# EAGLE design MP3 Breakout (EAGLE 9.0.1)
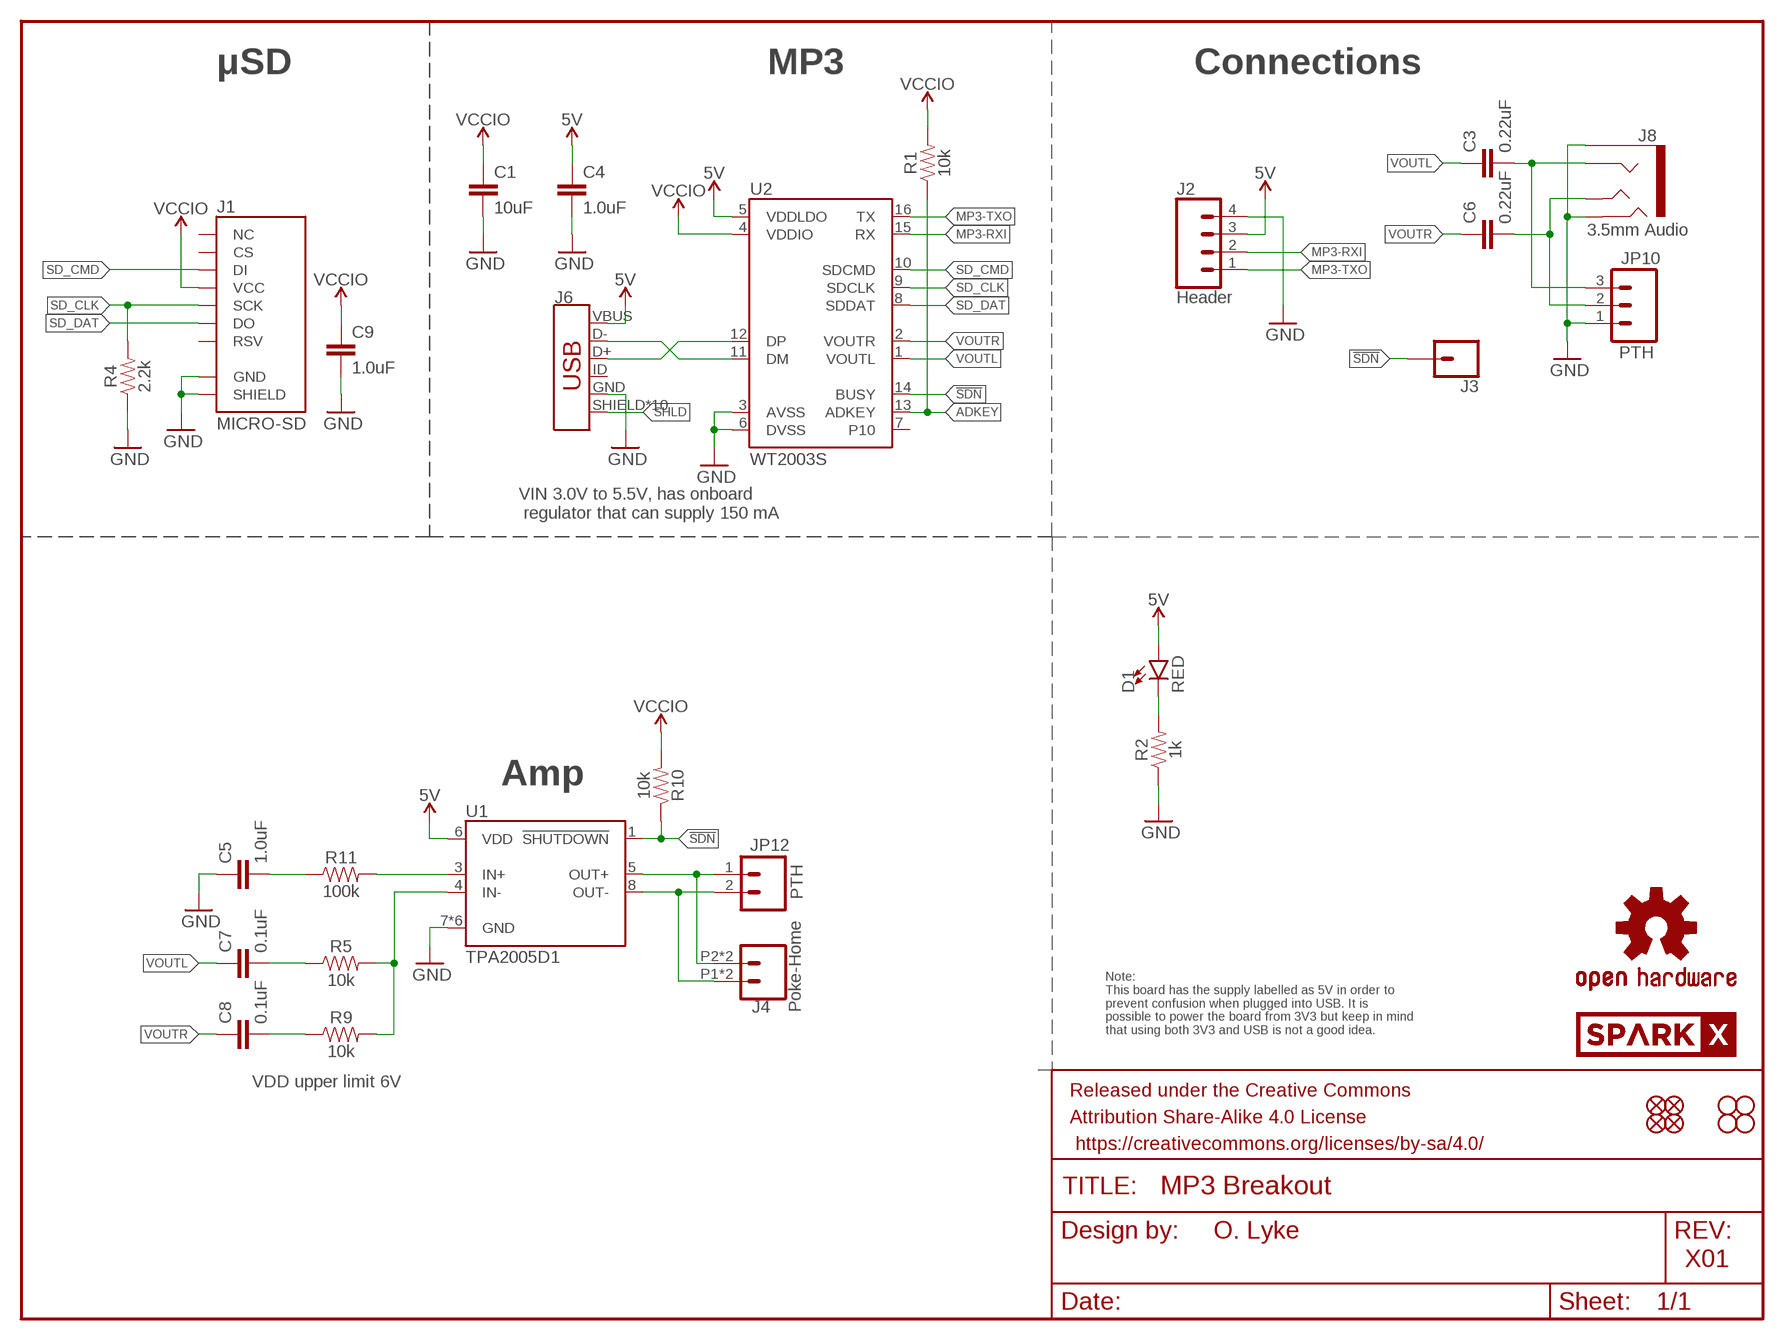
[diagram p0: schematic, sheet 1]

## Parts
C1  10uF  10UF-0603-6.3V-20%  [0603]
C3  0.22uF  0.22UF-0603-25V-10%  [0603]
C4  1.0uF  1.0UF-0603-16V-10%  [0603]
C5  1.0uF  1.0UF-0603-16V-10%  [0603]
C6  0.22uF  0.22UF-0603-25V-10%  [0603]
C7  0.1uF  0.1UF-0603-25V-(+80/-20%)  [0603]
C8  0.1uF  0.1UF-0603-25V-(+80/-20%)  [0603]
C9  1.0uF  1.0UF-0603-16V-10%  [0603]
D1  RED  LED-RED0603  [LED-0603]
FRAME1  FRAME-LETTER  [CREATIVE_COMMONS]
J1  MICRO-SD  MICRO-SD_CARD_SOCKETPUSH-PUSH  [MICRO-SD-SOCKET]
J2  Header  CONN_041X04_NO_SILK  [1X04_NO_SILK]
J3  CONN_01PTH_NO_SILK_YES_STOP  [1X01_NO_SILK]
J4  Poke-Home  CONN_02SMALL_POKEHOME  [1X02_POKEHOME]
J6  USB_MICRO-B_HALF_PTH_MILL  [USB-MICROB-PTH-MILL]
J8  3.5mm Audio  AUDIO_JACK_TRRSSMD_RA  [AUDIO_JACK_3.5MM_TRRS_SMD_RA]
JP1  FIDUCIALUFIDUCIAL  [MICRO-FIDUCIAL]
JP2  FIDUCIALUFIDUCIAL  [MICRO-FIDUCIAL]
JP3  STAND-OFF  [STAND-OFF]
JP4  STAND-OFF  [STAND-OFF]
JP5  FIDUCIALUFIDUCIAL  [MICRO-FIDUCIAL]
JP6  FIDUCIALUFIDUCIAL  [MICRO-FIDUCIAL]
JP10  PTH  CONN_031X03_NO_SILK  [1X03_NO_SILK]
JP11  STAND-OFF  [STAND-OFF]
JP12  PTH  CONN_021X02_NO_SILK  [1X02_NO_SILK]
JP13  STAND-OFF  [STAND-OFF]
LOGO1  OSHW-LOGOMINI  [OSHW-LOGO-MINI]
R1  10k  10KOHM-0603-1/10W-1%  [0603]
R2  1k  1KOHM-0603-1/10W-1%  [0603]
R4  2.2k  2.2KOHM-0603-1/10W-1%  [0603]
R5  10k  10KOHM-0603-1/10W-1%  [0603]
R9  10k  10KOHM-0603-1/10W-1%  [0603]
R10  10k  10KOHM-0603-1/10W-1%  [0603]
R11  100k  100KOHM-0603-1/10W-1%  [0603]
U1  TPA2005D1  TPA2005D1DRB  [QFN-8_PAD]
U2  WT2003S  [SO16]
U$2  SPARKX-LOGO4  [SPARKX-MEDIUM]

## Nets
5V: C4.1 D1.A J2.3 J6.VBUS U1.6(VDD) U2.5(VDDLDO)
!SDN: J3.1 R10.1 U1.1(!SHUTDOWN) U2.14(BUSY)
AC-L: C3.2 J8.RING1 JP10.3
AC-R: C6.2 J8.TIP JP10.2
ADKEY: R1.1 U2.13(ADKEY)
D+: J6.D+ U2.12(DP)
D-: J6.D- U2.11(DM)
GND: C1.2 C4.2 C5.1 C9.2 J1.CD1(SHIELD) J1.GND J2.4 J6.GND J8.EARTH J8.RING2 JP10.1 R2.1 R4.1 U1.7(GND) U1.9(GND) U1.10(GND) U1.11(GND) U1.12(GND) U1.13(GND) U2.3(AVSS) U2.6(DVSS)
IN+AMP: R11.2 U1.3(IN+)
IN-AMP: R5.2 R9.2 U1.4(IN-)
MP3-RXI: J2.2 U2.15(RX)
MP3-TXO: J2.1 U2.16(TX)
N$1: D1.C R2.2
N$5: C8.2 R9.1
N$8: C5.2 R11.1
N$9: C7.2 R5.1
OUT+: J4.P2 J4.P4 JP12.1 U1.5(OUT+)
OUT-: J4.P1 J4.P3 JP12.2 U1.8(OUT-)
SD_CLK: J1.SCLK(SCK) R4.2 U2.9(SDCLK)
SD_CMD: J1.DI U2.10(SDCMD)
SD_DAT: J1.DO U2.8(SDDAT)
SHLD: J6.SHIELD J6.SHIELD2(SHIELD) J6.SHIELD3(SHIELD) J6.SHIELD4(SHIELD) J6.SHIELD5(SHIELD) J6.SHIELD6(SHIELD) J6.SHIELD7(SHIELD) J6.SHIELD8(SHIELD) J6.SHIELD9(SHIELD) J6.SHIELD10(SHIELD)
VCCIO: C1.1 C9.1 J1.VCC R1.2 R10.2 U2.4(VDDIO)
VOUTL: C3.1 C7.1 U2.1(VOUTL)
VOUTR: C6.1 C8.1 U2.2(VOUTR)
Unconnected: J1.CS J1.RSV1(RSV) J1.RSV2(NC) J6.ID U2.7(P10)

## Notes on the sheet
- μSD | MP3 | Connections
- VIN 3.0V to 5.5V, has onboard
   regulator that can supply 150 mA
- Amp
- Note:
  This board has the supply labelled as 5V in order to 
  prevent confusion when plugged into USB. It is 
  possible to power the board from 3V3 but keep in mind 
  that using both 3V3 and USB is not a good idea.
- VDD upper limit 6V
- O. Lyke
- X01

## Library data of the parts
C1 = SparkFun-Capacitors:10UF: 10.0µF ceramic capacitors A capacitor is a passive two-terminal electrical component used to store electrical energy temporarily in an electric field.; PROD_ID: CAP-11015
C3 C6 = SparkFun-Capacitors:0.22UF: 0.22µF ceramic capacitors A capacitor is a passive two-terminal electrical component used to store electrical energy temporarily in an electric field.; PROD_ID: CAP-07822
C4 C5 C9 = SparkFun-Capacitors:1.0UF: 1µF ceramic capacitors A capacitor is a passive two-terminal electrical component used to store electrical energy temporarily in an electric field.; PROD_ID: CAP-00868
C7 C8 = SparkFun-Capacitors:0.1UF: 0.1µF ceramic capacitors A capacitor is a passive two-terminal electrical component used to store electrical energy temporarily in an electric field.; PROD_ID: CAP-00810
D1 = SparkFun-LED:LED-RED: Red SMD LED Used in manufacturing of most products at SparkFun Packages: 0603 - SMD 0603 package [Product Link] <http://docs.avagotech.com/docs/AV02-0551EN> 0603 SMART - SMD 0603 SMART package ( more efficient and expensive)[Product Link] <http://www.osram-os.com/Graphics/XPic2/00077099_0.pdf> 1206 - SMD1206 package [Product Link] <https://www.sparkfun.com/datasheets/DevTools/LilyPad/Q150OVS4.pdff> SparkFun Products: Pro Mini 328 -5V <https://www.sparkfun.com/products/821> RedBoard <https://www.sparkfun.com/products/12757> IOIO-OTG <https://www.sparkfun.com/products/13613>; PROD_ID: DIO-00819
FRAME1 = SparkFun-Aesthetics:FRAME-LETTER: Schematic Frame - Letter Standard 8.5x11 US Letter frame
J1 = SparkFun-Connectors:MICRO-SD_CARD_SOCKET: microSD Socket for Transflash Push-push type µSD socket. tDoc lines correctly indicate media card edge positions when inserting (unlocked, locked, depressed). NOTE: CD1 and CD2 are connected internally, and the default detect state of the socket is detect pin to ground. SparkFun Products: WAV Trigger <https://www.sparkfun.com/products/13660> CAN-Bus Shield <https://www.sparkfun.com/products/13262> SparkFun Level Shifing microSD Breakout <https://www.sparkfun.com/products/13743>; PROD_ID: CONN-07820
J2 = SparkFun-Connectors:CONN_04: Multi connection point. Often used as Generic Header-pin footprint for 0.1 inch spaced/style header connections On any of the 0.1 inch spaced packages, you can populate with these: Break Away Headers - Straight <https://www.sparkfun.com/products/116> (PRT-00116) Break Away Male Headers - Right Angle <https://www.sparkfun.com/products/553> (PRT-00553) Female Headers <https://www.sparkfun.com/products/115> (PRT-00115) Break Away Headers - Machine Pin <https://www.sparkfun.com/products/117> (PRT-00117) Break Away Female Headers - Swiss Machine Pin <https://www.sparkfun.com/products/743> (PRT-00743) For SCREWTERMINALS and SPRING TERMINALS visit here: Screw Terimnals on SparkFun.com <https://www.sparkfun.com/search/results?term=Screw+Terminals> (5mm/3.5mm/2.54mm spacing) This device is also useful as a general connection point to wire up your design to another part of your project. Our various solder wires solder well into these plated through hole pads. Hook-Up Wire - Assortment (Stranded, 22 AWG) <https://www.sparkfun.com/products/11375> (PRT-11375) Hook-Up Wire - Assortment (Solid Core, 22 AWG) <https://www.sparkfun.com/products/11367> (PRT-11367) View the entire wire category on our website here <https://www.sparkfun.com/categories/141> Special notes: Molex polarized connector foot print use with SKU : PRT-08231 with associated crimp pins and housings. 1MM SMD Version SKU: PRT-10208; PROD_ID: CONN-09696
J3 = SparkFun-Connectors:CONN_01: Single connection point. Often used as Generic Header-pin footprint for 0.1 inch spaced/style header connections On any of the 0.1 inch spaced packages, you can populate with these: Break Away Headers - Straight <https://www.sparkfun.com/products/116> (PRT-00116) Break Away Male Headers - Right Angle <https://www.sparkfun.com/products/553> (PRT-00553) Female Headers <https://www.sparkfun.com/products/115> (PRT-00115) Break Away Headers - Machine Pin <https://www.sparkfun.com/products/117> (PRT-00117) Break Away Female Headers - Swiss Machine Pin <https://www.sparkfun.com/products/743> (PRT-00743) This device is also useful as a general connection point to wire up your design to another part of your project. Our various solder wires solder well into these plated through hole pads. Hook-Up Wire - Assortment (Stranded, 22 AWG) <https://www.sparkfun.com/products/11375> (PRT-11375) Hook-Up Wire - Assortment (Solid Core, 22 AWG) <https://www.sparkfun.com/products/11367> (PRT-11367) View the entire wire category on our website here <https://www.sparkfun.com/categories/141> Special notes: SMTSO-256-ET is a "flush mount" nut for a 4-40 screw. We mostly use this on specialty testbeds; it is a nice way to connect hardware to your PCB at an adjustable hieght. Also note, the SNAP packages are for using a snappable style connector. We sell a baggie of snaps and they are also used on two LilyPad designs: Snap Assortment - 30 pack (male and female) <https://www.sparkfun.com/products/11347> (DEV-11347) LilyPad Arduino SimpleSnap <https://www.sparkfun.com/products/10941> (DEV-10941) LilyPad SimpleSnap Protoboard <https://www.sparkfun.com/products/10940> (DEV-10940)
J4 = SparkFun-Connectors:CONN_02: Multi connection point. Often used as Generic Header-pin footprint for 0.1 inch spaced/style header connections On any of the 0.1 inch spaced packages, you can populate with these: Break Away Headers - Straight <https://www.sparkfun.com/products/116> (PRT-00116) Break Away Male Headers - Right Angle <https://www.sparkfun.com/products/553> (PRT-00553) Female Headers <https://www.sparkfun.com/products/115> (PRT-00115) Break Away Headers - Machine Pin <https://www.sparkfun.com/products/117> (PRT-00117) Break Away Female Headers - Swiss Machine Pin <https://www.sparkfun.com/products/743> (PRT-00743) For SCREWTERMINALS and SPRING TERMINALS visit here: Screw Terimnals on SparkFun.com <https://www.sparkfun.com/search/results?term=Screw+Terminals> (5mm/3.5mm/2.54mm spacing) This device is also useful as a general connection point to wire up your design to another part of your project. Our various solder wires solder well into these plated through hole pads. Hook-Up Wire - Assortment (Stranded, 22 AWG) <https://www.sparkfun.com/products/11375> (PRT-11375) Hook-Up Wire - Assortment (Solid Core, 22 AWG) <https://www.sparkfun.com/products/11367> (PRT-11367) View the entire wire category on our website here <https://www.sparkfun.com/categories/141> Special notes: Molex polarized connector foot print use with: PRT-08233 with associated crimp pins and housings. 2.54_SCREWTERM for use with PRT-10571. 3.5mm Screw Terminal footprints for PRT-08084 5mm Screw Terminal footprints for use with PRT-08432; PROD_ID: CONN-13512
J6 = SparkFun-Connectors:USB_MICRO-B: USB Type Micro-B Connector Male/female and PTH/SMT variants SparkFun Products: SparkFun microB USB Breakout <https://www.sparkfun.com/products/12035> SparkFun USB microB Plug Breakout <https://www.sparkfun.com/products/10031> SparkFun ESP8266 Thing <https://www.sparkfun.com/products/13231>; PROD_ID: CONN-13711
J8 = SparkFun-Connectors:AUDIO_JACK_TRRS: Audio Jack - 3.5mm TRRS (SMD) This is a 3.5mm TRRS SMD audio jack. TRRS connectors are the audio-style connectors that you see on some phones, MP3 players and development boards. TRRS stands for “tip, ring, ring, sleeve,” which reflects that this has three conductors and a ground. SparkFun Products: Audio Jack <https://www.sparkfun.com/products/12639> mbed Starter Kit <https://www.sparkfun.com/products/12968> SparkFun TRRS 3.5mm Jack Breakout <https://www.sparkfun.com/products/11570>; PROD_ID: CONN-10676; SF_ID: PRT-12639
JP1 JP2 JP5 JP6 = SparkFun:FIDUCIAL: Fiducial Alignment Points Various fiducial points for machine vision alignment.
JP3 JP4 JP11 JP13 = SparkFun:STAND-OFF: Stand Off This is the mechanical footprint for a #4 phillips button head screw. Use the keepout ring to avoid running the screw head into surrounding components. SKU : PRT-00447
JP10 = SparkFun-Connectors:CONN_03: Multi connection point. Often used as Generic Header-pin footprint for 0.1 inch spaced/style header connections On any of the 0.1 inch spaced packages, you can populate with these: Break Away Headers - Straight <https://www.sparkfun.com/products/116> (PRT-00116) Break Away Male Headers - Right Angle <https://www.sparkfun.com/products/553> (PRT-00553) Female Headers <https://www.sparkfun.com/products/115> (PRT-00115) Break Away Headers - Machine Pin <https://www.sparkfun.com/products/117> (PRT-00117) Break Away Female Headers - Swiss Machine Pin <https://www.sparkfun.com/products/743> (PRT-00743) Stackable Header - 3 Pin (Female, 0.1") <https://www.sparkfun.com/products/13875> (PRT-13875) For SCREWTERMINALS and SPRING TERMINALS visit here: Screw Terimnals on SparkFun.com <https://www.sparkfun.com/search/results?term=Screw+Terminals> (5mm/3.5mm/2.54mm spacing) This device is also useful as a general connection point to wire up your design to another part of your project. Our various solder wires solder well into these plated through hole pads. Hook-Up Wire - Assortment (Stranded, 22 AWG) <https://www.sparkfun.com/products/11375> (PRT-11375) Hook-Up Wire - Assortment (Solid Core, 22 AWG) <https://www.sparkfun.com/products/11367> (PRT-11367) View the entire wire category on our website here <https://www.sparkfun.com/categories/141> Special notes: Molex polarized connector foot print use with SKU : PRT-08232 with associated crimp pins and housings.
JP12 = SparkFun-Connectors:CONN_02: Multi connection point. Often used as Generic Header-pin footprint for 0.1 inch spaced/style header connections On any of the 0.1 inch spaced packages, you can populate with these: Break Away Headers - Straight <https://www.sparkfun.com/products/116> (PRT-00116) Break Away Male Headers - Right Angle <https://www.sparkfun.com/products/553> (PRT-00553) Female Headers <https://www.sparkfun.com/products/115> (PRT-00115) Break Away Headers - Machine Pin <https://www.sparkfun.com/products/117> (PRT-00117) Break Away Female Headers - Swiss Machine Pin <https://www.sparkfun.com/products/743> (PRT-00743) For SCREWTERMINALS and SPRING TERMINALS visit here: Screw Terimnals on SparkFun.com <https://www.sparkfun.com/search/results?term=Screw+Terminals> (5mm/3.5mm/2.54mm spacing) This device is also useful as a general connection point to wire up your design to another part of your project. Our various solder wires solder well into these plated through hole pads. Hook-Up Wire - Assortment (Stranded, 22 AWG) <https://www.sparkfun.com/products/11375> (PRT-11375) Hook-Up Wire - Assortment (Solid Core, 22 AWG) <https://www.sparkfun.com/products/11367> (PRT-11367) View the entire wire category on our website here <https://www.sparkfun.com/categories/141> Special notes: Molex polarized connector foot print use with: PRT-08233 with associated crimp pins and housings. 2.54_SCREWTERM for use with PRT-10571. 3.5mm Screw Terminal footprints for PRT-08084 5mm Screw Terminal footprints for use with PRT-08432
LOGO1 = SparkFun-Aesthetics:OSHW-LOGO: Open-Source Hardware (OSHW) Logo This logo indicates the piece of hardware it is found on incorporates a OSHW license and/or adheres to the definition of open source hardware found here: http://freedomdefined.org/OSHW
R1 R5 R9 R10 = SparkFun-Resistors:10KOHM: 10kΩ resistor A resistor is a passive two-terminal electrical component that implements electrical resistance as a circuit element. Resistors act to reduce current flow, and, at the same time, act to lower voltage levels within circuits. - Wikipedia; PROD_ID: RES-00824
R2 = SparkFun-Resistors:1KOHM: 1kΩ resistor A resistor is a passive two-terminal electrical component that implements electrical resistance as a circuit element. Resistors act to reduce current flow, and, at the same time, act to lower voltage levels within circuits. - Wikipedia; PROD_ID: RES-07856
R4 = SparkFun-Resistors:2.2KOHM: 2.2kΩ resistor A resistor is a passive two-terminal electrical component that implements electrical resistance as a circuit element. Resistors act to reduce current flow, and, at the same time, act to lower voltage levels within circuits. - Wikipedia; PROD_ID: RES-08272
R11 = SparkFun-Resistors:100KOHM: 100kΩ resistor A resistor is a passive two-terminal electrical component that implements electrical resistance as a circuit element. Resistors act to reduce current flow, and, at the same time, act to lower voltage levels within circuits. - Wikipedia; PROD_ID: RES-07828
U1 = SparkFun-IC-Amplifiers:TPA2005D1: 1.4W MONO CLASS-D AUDIO POWER AMPLIFIER The TPA2005D1 is a 1.4-W high efficiency filter-free class-D audio power amplifier in a BGA, QFN, or MSOP package that requires only three external components. Datasheet: http://focus.ti.com/lit/ds/symlink/tpa2005d1.pdf 1.4 W Into 8 ? From a 5V Supply at THD = 10% (Typ) Maximum Battery Life and Minimum Heat Efficiency With an 8-? Speaker: 84% at 400 mW, 79% at 100 mW 2.8-mA Quiescent Current 0.5-mA Shutdown Current Ideal for Wireless or Cellular Handsets and PDAs Capable of Driving an 8-? Speaker (2.5 V ? VDD ? 5.5 V) and a 4-? Speaker (2.5 V ? VDD ? 4.2 V) Only Three External Components Optimized PWM Output Stage Eliminates LC Output Filter Internally Generated 250-kHz Switching Frequency Eliminates Capacitor and Resistor Improved PSRR (-71 dB at 217 Hz) and Wide Supply Voltage (2.5 V to 5.5 V) Eliminates Need for a Voltage Regulator Fully Differential Design Reduces RF Rectification and Eliminates Bypass Capacitor Improved CMRR Eliminates Two Input Coupling Capacitors SparkFun Products SparkFun Mono Audio Amp Breakout - TPA2005D1 <https://www.sparkfun.com/products/11044> (BOB-11044) Note: SparkFun currenly only uses the QFN style part; PROD_ID: IC-10975
U2 = WT2003S:WT2003S
U$2 = SparkX:SPARKX-LOGO

## Net classes
1 3.3V: width 0.152 mm

## Board
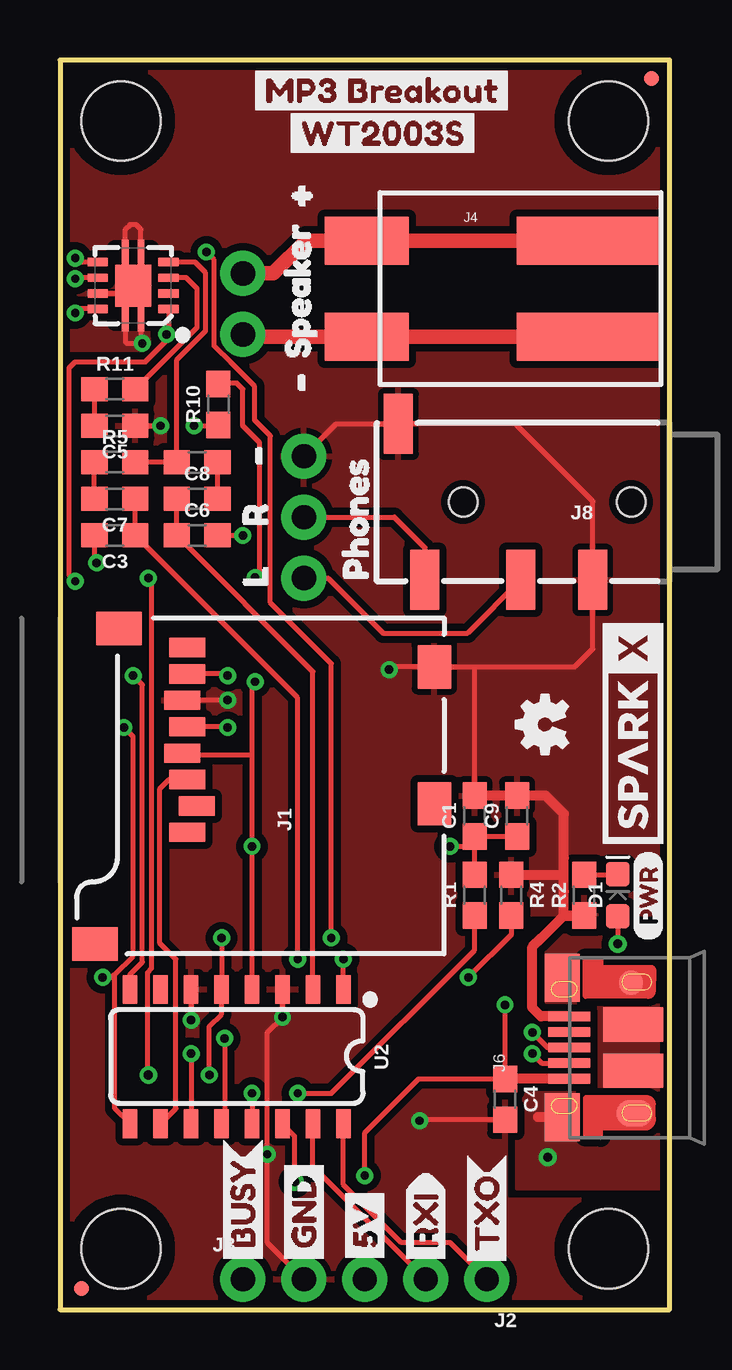
[diagram p1: board, top side]
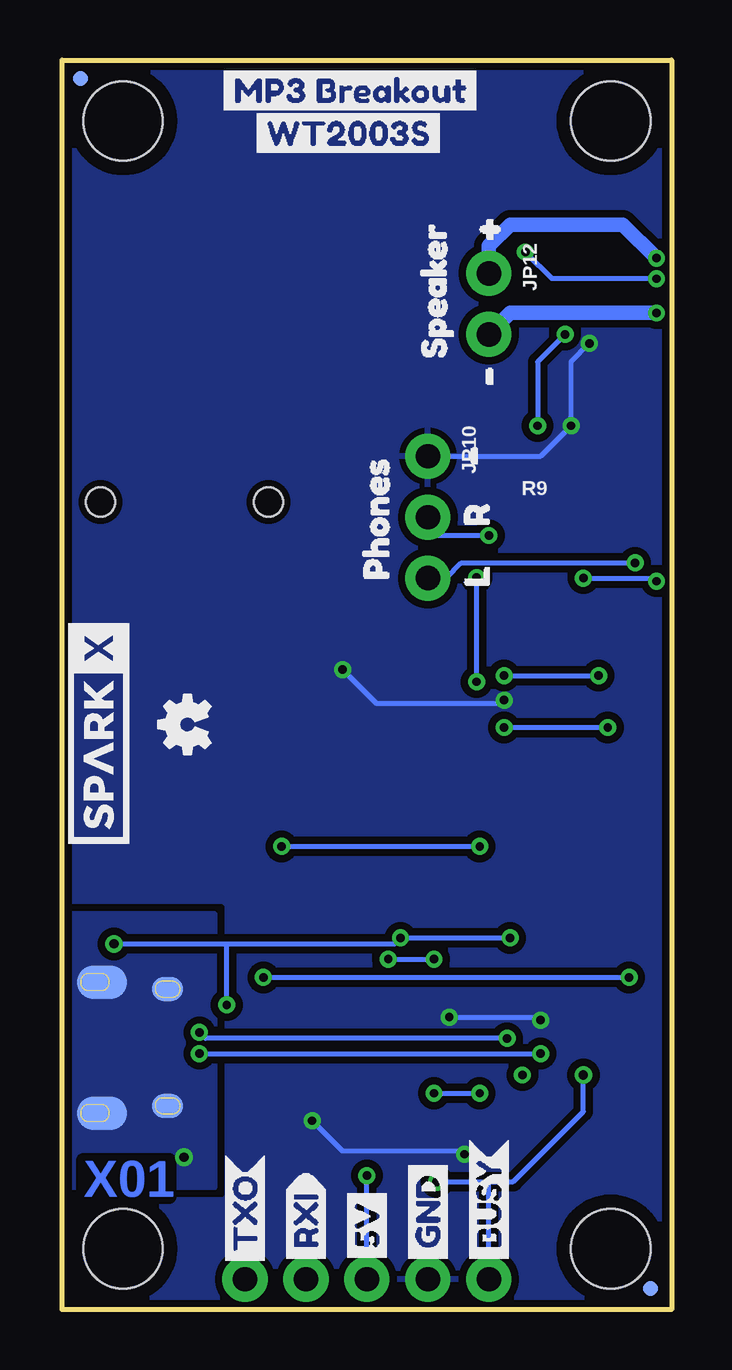
[diagram p2: board, bottom side, seen from below]

Size 25.4 x 52.07 mm. Coordinates in mm from the lower left corner, seen from the top.
Outline: 25.4,0 25.4,52.07 0,52.07 0,0 25.4,0
Copper layers (1*16): Top 0.035mm / dielectric 1.5mm / Bottom 0.035mm
Design rules "SparkFun-2-layer-PCBWay-LIMIT *": minimum track width 6mil, minimum drill 0.3mm, track to track 6mil, track to pad 6mil, pad to pad 6mil, via to via 6mil, smd to smd 6mil, copper to edge 6mil, drill to drill 6mil, minimum pad ring 7mil, minimum via ring 7mil, stop-mask expansion 4mil, vias tented up to drill 25mil, thermal gap 10mil

### Footprints (pad centres in the part's own frame; a part is rotated, then mirrored left to right if it is on the bottom)
0603 = smd 1.1 x 1: 1 -0.85,0; 2 0.85,0
LED-0603 = smd 1 x 1: A -0.877,0; C 0.877,0
MICRO-SD-SOCKET = smd 1.8 x 1.4: CD1 -2.05,0.4; CD2 -7.75,0.4 | smd 0.8 x 1.5: CS -7.84,10.3; DI -6.74,10.7; DO -2.34,10.7; GND -3.44,10.9; RSV1 -8.94,10.7; RSV2 -1.24,10.7; SCLK -4.54,10.7; VCC -5.64,10.9 | smd 1.4 x 1.9: GND1 -13.6,14.55; GND3 -0.45,13.55
1X04_NO_SILK = drill 1.016 pad 1.88: 1 0,0; 2 2.54,0; 3 5.08,0; 4 7.62,0
1X01_NO_SILK = drill 1.016 pad 1.88: 1 0,0
1X02_POKEHOME = smd 3.5 x 2: P1 5.25,2; P2 5.25,-2 | smd 6 x 2: P3 -4,2; P4 -4,-2
USB-MICROB-PTH-MILL = smd 0.4 x 1.75: D+ 0,0; D- -0.65,0; GND 1.3,0; ID 0.65,0; VBUS -1.3,0 | smd 2 x 1.46: SHIELD -2.9,0.275; SHIELD2 2.9,0.275 | smd 1.425 x 2.5: SHIELD3 -0.963,-2.675; SHIELD4 0.963,-2.675 | smd 1.4 x 2.1 bottom: SHIELD5 -2.731,-2.531; SHIELD7 2.729,-2.531 | smd 1 x 1: SHIELD6 2.7,-2.575 | smd 1.1 x 1.5: SHIELD8 -2.731,-2.731 | smd 1 x 1.3 bottom: SHIELD9 -2.43,0.195; SHIELD10 2.43,0.195
AUDIO_JACK_3.5MM_TRRS_SMD_RA = smd 1.2 x 2.5: EARTH 11.3,-3.25; RING1 6.2,3.25; RING2 3.2,3.25; TIP 10.2,3.25 | hole 1.2: 1.6,0; 8.6,0
MICRO-FIDUCIAL = smd 0.635 x 0.635: 1 0,0
STAND-OFF = hole 3.302: 0,0
1X03_NO_SILK = drill 1.016 pad 1.88: 1 0,0; 2 2.54,0; 3 5.08,0
1X02_NO_SILK = drill 1.016 pad 1.88: 1 0,0; 2 2.54,0
QFN-8_PAD = smd 0.35 x 0.85: 1 -0.975,-1.475; 2 -0.325,-1.475; 3 0.325,-1.475; 4 0.975,-1.475; 5 0.975,1.475; 6 0.325,1.475; 7 -0.325,1.475; 8 -0.975,1.475 | smd 1.75 x 1.5: 9 0,0 | smd 1.025 x 0.28: 10 -1.387,-0.325; 11 1.387,-0.325; 12 1.387,0.325; 13 -1.387,0.325
SO16 = smd 0.6 x 1.2: 1 -4.445,-2.8; 2 -3.175,-2.8; 3 -1.905,-2.8; 4 -0.635,-2.8; 5 0.635,-2.8; 6 1.905,-2.8; 7 3.175,-2.8; 8 4.445,-2.8; 9 4.445,2.8; 10 3.175,2.8; 11 1.905,2.8; 12 0.635,2.8; 13 -0.635,2.8; 14 -1.905,2.8; 15 -3.175,2.8; 16 -4.445,2.8

### Placement (x,y rotation side)
C1  17.27,20.57 90 top
C3  2.29,32.26 180 top
C4  18.54,8.76 270 top
C5  2.29,36.83 180 top
C6  5.71,32.26 0 top
C7  2.29,33.78 180 top
C8  5.71,33.78 0 top
C9  19.05,20.57 90 top
D1  23.24,17.27 90 top
FRAME1  -16.64,-15.88 0 top  (outside the outline)
J1  16,28.83 90 top
J2  17.78,1.27 180 top
J3  7.62,1.27 0 top
J4  18.03,42.55 180 top
J6  21.21,10.92 90 top
J8  25.4,33.66 180 top
JP1  24.64,51.31 0 top
JP2  0.89,0.89 0 bottom
JP3  22.86,49.53 0 top
JP4  2.54,49.53 0 top
JP5  0.89,0.89 0 top
JP6  24.64,51.31 0 bottom
JP10  10.16,35.56 270 bottom
JP11  22.86,2.54 0 top
JP12  7.62,43.18 270 bottom
JP13  2.54,2.54 0 top
LOGO1  20.19,24.38 90 top
LOGO2  OSHW-LOGOMINI  [OSHW-LOGO-MINI@1]  20.19,24.38 90 bottom
R1  17.27,17.27 90 top
R2  21.84,17.27 90 top
R4  18.8,17.27 270 top
R5  2.29,35.31 0 top
R9  5.71,35.31 180 top
R10  6.6,37.72 90 top
R11  2.29,38.35 0 top
U1  3.05,42.67 90 top
U2  7.37,10.54 180 top
U$1  [GND1]  10.16,1.65 90 bottom
U$2  23.88,24 90 top
U$3  [L12]  8.13,29.21 90 bottom
U$4  [R11]  8.13,31.75 90 bottom
U$6  [TXO0]  17.78,1.52 90 top
U$7  [RXI0]  15.24,1.65 90 top
U$8  [RXI0]  15.24,1.65 90 bottom
U$9  [TXO0]  17.78,1.52 90 bottom
U$10  [#6]  8,34.04 90 top
U$11  SPARKX-LOGO4  [SPARKX-MEDIUM]  23.88,24 90 bottom
U$12  [MP3_BREAKOUT0]  7.62,50.8 0 top
U$13  [BUSY0]  7.62,1.65 90 top
U$14  [BUSY0]  7.62,1.65 90 bottom
U$15  [#6]  8.51,34.04 90 bottom
U$16  [PHONES0]  12.32,29.34 90 bottom
U$17  [PWR-()-03]  24.51,15.37 90 top
U$18  [SPEAKER1]  9.91,38.73 90 bottom
U$19  [#5]  7.75,43.43 90 bottom
U$20  [SPEAKER1]  9.91,38.73 90 top
U$21  [#6]  7.87,37.34 90 bottom
U$22  [GND1]  10.16,1.65 90 top
U$23  [RXI0]  15.24,1.65 90 top
U$24  [MP3_BREAKOUT0]  19.18,50.8 0 bottom
U$25  [#6]  9.78,37.08 90 top
U$26  [WT2003S0]  9.14,49.02 0 top
U$27  [WT2003S0]  17.78,49.02 0 bottom
U$28  [#5]  9.91,44.83 90 top
U$29  [5V0]  12.7,1.65 90 top
U$30  [5V0]  12.7,1.65 90 bottom
U$39  [R11]  8.13,31.75 90 top
U$40  [PHONES0]  12.32,29.34 90 top
U$41  [L12]  8.13,29.21 90 top

### Tracks (layer width: path | path; a pad name or v marks a point on that pad's centre or on a via)
5V  (via drill 0.35, 0.38)
  Top 0.203: v6.22,9.78 6.22,11.81 6.73,12.32 U2.5 v6.73,15.49 | v0.64,42.96 0.68,43 U1.6 | 18.58,9.65 C4.1 | v12.7,5.59 12.7,7.37 14.95,9.61 C4.1 | C4.1 v18.54,12.7 | v11.3,15.49 11.3,26.92 8.76,29.46 8.76,36.41 8.11,37.06 8.11,38.47 7.14,39.45 7.13,39.45 6.43,40.15 6.43,43.74 v6.1,44.07 | D1.A v23.24,15.24
  Top 0.406: J6.VBUS 18.55,9.62 C4.1
  Bottom 0.203: v6.73,15.49 v11.3,15.49 11.56,15.24 18.54,15.24 | v0.64,42.96 4.98,42.96 v6.1,44.07 | J2.3 v12.7,5.59 | v23.24,15.24 18.54,15.24 | v18.54,12.7 18.54,15.24
!SDN  (via drill 0.35, 0.38)
  Top 0.203: U1.1 4.52,40.72 v4.45,40.64 4.45,40.39 3.56,39.5 0.64,39.5 0.38,39.24 0.38,30.61 v0.64,30.35 | v5.59,36.83 6.57,36.83 R10.1 | v3.68,30.48 3.81,30.35 3.81,14.22 3.64,14.05 3.64,9.82 v3.68,9.78 | v9.78,5.33 9.78,7.23 U2.14
  Bottom 0.203: v4.45,40.64 5.59,39.5 v5.59,36.83 | v3.68,30.48 0.76,30.48 v0.64,30.35 | v3.68,9.78 3.68,8.26 6.6,5.33 7.62,5.33 | v9.78,5.33 7.62,5.33 | J3.1 7.62,5.33
AC-L  (via drill 0.35)
  Top 0.203: C3.2 1.44,31.2 v1.52,31.11 | 19.2,29.95 J8.RING1 16.99,28.19 13.46,28.19 11.18,30.48 JP10.3
  Bottom 0.203: v1.52,31.11 8.76,31.11 9.4,30.48 JP10.3
AC-R  (via drill 0.35)
  Top 0.203: J8.TIP 15.2,31.75 13.93,33.02 JP10.2 | C6.2 v7.62,32.26
  Bottom 0.203: v7.62,32.26 9.78,32.26 9.78,32.64 JP10.2
ADKEY  (via drill 0.35)
  Top 0.203: v9.91,9.02 11.3,9.02 17.27,14.99 R1.1 | v8,9.02 U2.13
  Bottom 0.203: v9.91,9.02 v8,9.02
D+  (via drill 0.35)
  Top 0.203: v6.86,11.3 6.86,7.87 U2.12 | v19.68,11.56 20.32,10.92 J6.D+
  Bottom 0.203: v6.86,11.3 19.43,11.3 v19.68,11.56
D-  (via drill 0.35)
  Top 0.203: v5.46,10.67 U2.11 | v19.68,10.67 20.08,10.27 J6.D-
  Bottom 0.203: v19.68,10.67 v5.46,10.67
GND  (via drill 0.35)
  Top 0.203: U1.7 2.72,42.35 | C5.1 v4.19,36.83 | U1.10 3.37,40.31 v3.43,40.26 2.79,40.26 2.72,40.33 U1.13 2.72,42.35 | 3.05,42.55 U1.9 2.72,42.35 | 3.05,42.55 3.05,41.9 | 3.05,42.55 3.37,42.87 U1.11 3.37,45.01 3.17,45.21 2.92,45.21 2.72,45.01 U1.12 | 17.78,21.42 C1.2 17.27,26.78 | U2.3 v9.27,12.19 8.64,11.56 v8.64,6.48 8.64,2.79 J2.4 | U2.6 v5.46,12.06 | v6.99,25.4 5.11,25.4 J1.GND | 17.27,26.78 J1.CD1 13.82,26.78 v13.72,26.67 | 17.27,26.78 21.45,26.78 22.2,27.53 J8.RING2 22.2,33.68 18.98,36.91 J8.EARTH 11.51,36.91 JP10.1 | C4.2 15.03,7.91 v14.99,7.87 | R2.1 21.76,16.51 20.87,16.51
  Top 0.406: J6.GND 20.04,12.22 19.68,12.57 19.68,15.11 20.07,15.49 20.99,16.42 | 20.99,16.42 R2.1 | 17.78,21.42 C9.2 20.23,21.42 20.99,20.66 20.99,18.82 20.99,18.16 | 20.99,16.42 20.99,17.42 20.99,17.43 20.99,18.16 | R4.1 20.95,18.12 20.99,18.16
  Bottom 0.203: v3.43,40.26 4.19,39.5 v4.19,36.83 5.46,35.56 JP10.1 | v8.64,6.48 8.76,6.6 13.72,6.6 v14.99,7.87 | v9.27,12.19 5.59,12.19 v5.46,12.06 | v6.99,25.4 7.11,25.27 12.32,25.27 v13.72,26.67
  pour Top (isolate 0.305, rank 2): 25.4,0 25.4,5.08 19.05,5.08 19.05,16.51 25.4,16.51 25.4,52.07 0,52.07 0,0
  pour Bottom (isolate 0.305, rank 2): 25.4,0 25.4,5.08 19.05,5.08 19.05,16.51 25.4,16.51 25.4,52.07 0,52.07 0,0
IN+AMP
  Top 0.203: U1.3 5.25,43.01 5.71,42.55 5.71,40.93 R11.2
IN-AMP
  Top 0.203: R5.2 R9.2 4.87,39.58 6.07,40.79 6.07,43.2 5.63,43.65 U1.4
MP3-RXI
  Top 0.203: U2.15 10.54,5.97 J2.2
MP3-TXO
  Top 0.203: U2.16 11.81,5.21 14.22,2.79 16.26,2.79 J2.1
N$1
  Top 0.203: R2.2 23.21,18.12 D1.C
N$5
  Top 0.203: C8.2 R9.1
N$8
  Top 0.203: R11.1 C5.2
N$9
  Top 0.203: C7.2 R5.1
OUT+  (via drill 0.35)
  Top 0.203: U1.5 0.8,43.65 v0.64,43.81
  Top 0.61: JP12.1 8.89,43.18 10.26,44.55 J4.P2 J4.P4
  Bottom 0.61: v0.64,43.81 2.03,45.21 6.73,45.21 7.62,44.32 JP12.1
OUT-  (via drill 0.35)
  Top 0.203: U1.8 0.8,41.7 v0.64,41.53
  Top 0.61: J4.P3 20.41,40.55 20.32,40.64 20.23,40.55 J4.P1 7.71,40.55 JP12.2
  Bottom 0.61: v0.64,41.53 6.73,41.53 JP12.2
SD_CLK  (via drill 0.35)
  Top 0.203: U2.9 2.29,8.38 2.29,13.97 | 2.29,13.97 3.05,14.73 3.05,23.88 v2.67,24.26 | R4.2 18.8,15.62 v17.02,13.84 | v1.78,13.84 2.16,13.84 2.29,13.97 | v6.99,24.26 6.95,24.29 J1.SCLK
  Bottom 0.203: v2.67,24.26 v6.99,24.26 | v17.02,13.84 v1.78,13.84
SD_CMD
  Top 0.203: U2.10 4.83,8.38 4.83,14.61 4.17,15.27 4.17,21.71 4.54,22.09 J1.DI
SD_DAT  (via drill 0.35)
  Top 0.203: v3.05,26.42 3.43,26.04 3.43,14.48 2.92,13.97 U2.8 | v6.99,26.42 6.91,26.49 J1.DO
  Bottom 0.203: v6.99,26.42 v3.05,26.42
SHLD  (via drill 0.38)
  Top 0.406: J6.SHIELD6 23.34,13.62 23.11,13.84 | J6.SHIELD 19.92,8.02
  other vias: 20.32,6.35
  pour Top (isolate 0.305, no thermals): 25.4,16.51 19.05,16.51 19.05,5.08 25.4,5.08
  pour Bottom (isolate 0.305, no thermals): 25.4,16.51 19.05,16.51 19.05,5.08 25.4,5.08
VCCIO  (via drill 0.35)
  Top 0.203: U2.4 v8,19.3 8,23.11 | J1.VCC 5.18,23.11 8,23.11 | R1.2 C1.1 | C1.1 C9.1 | 16.3,19.34 v16.26,19.3 16.85,19.3 C1.1 | 8,23.11 8,26.04 v8.13,26.16 | R10.2 6.64,38.61 7.37,38.61 7.62,38.35 7.62,36.83 8.32,36.13 8.32,30.7 v8.13,30.51
  Bottom 0.203: v16.26,19.3 v8,19.3 | v8.13,26.16 v8.13,30.51
VOUTL  (via drill 0.35)
  Top 0.203: C7.1 C3.1 9.91,25.49 v9.91,14.61 | U2.1 v11.81,14.61
  Bottom 0.203: v11.81,14.61 v9.91,14.61
VOUTR
  Top 0.203: C8.1 C6.1 10.54,26.58 U2.2

### Text on the board
Bottom: X01
bValues: TPA2005D1
tDocu: Owen Lyke